# EAGLE design audible (EAGLE 7.5.0)
AUTHOR: BLEES Dev Team; REV: A; TITLE: BLEES Sensor Board
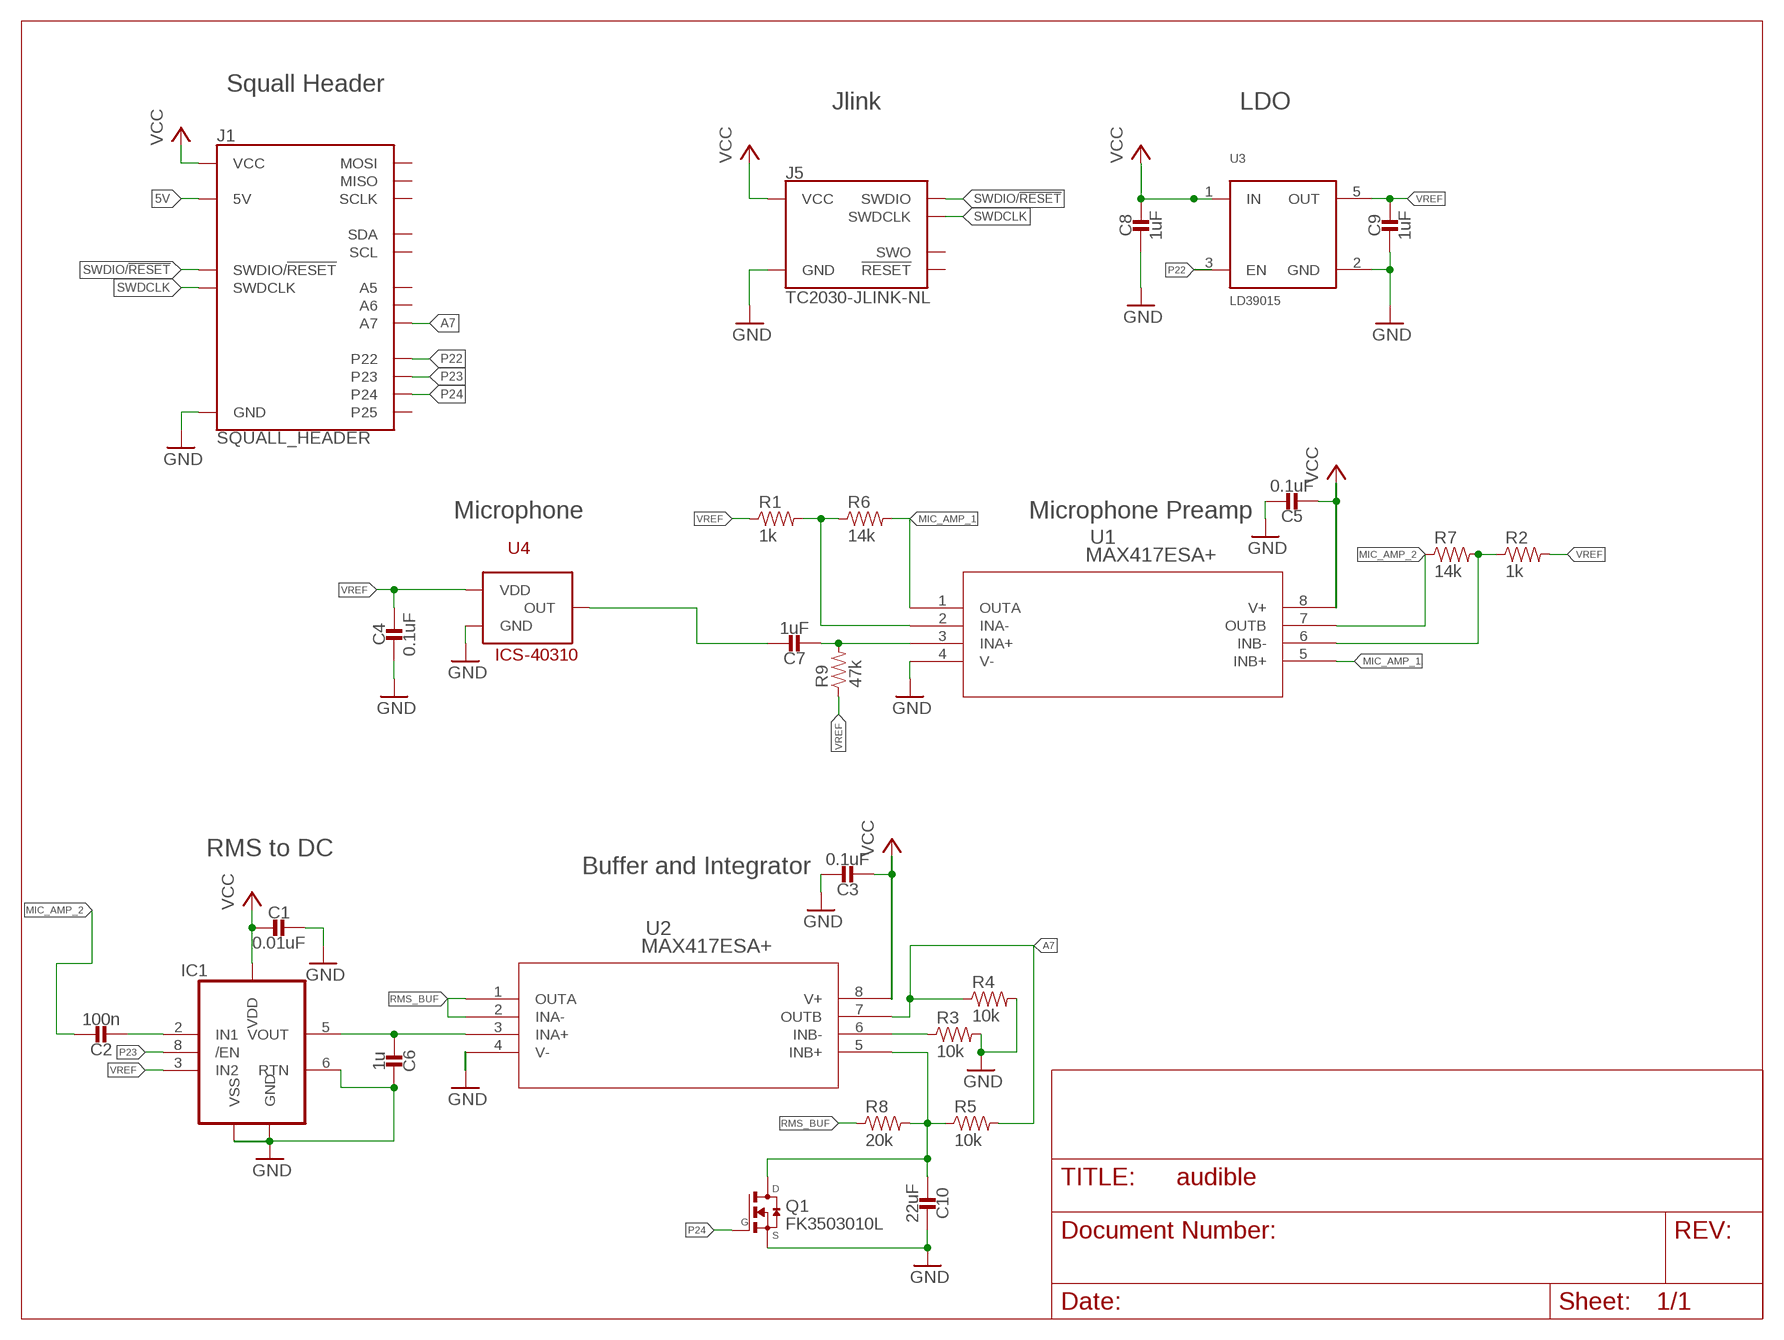
[diagram p0: schematic, sheet 1]

## Parts
C1  0.01uF  CAPACITOR  [0402_CAP]
C2  100n  CAPACITOR  [0402_CAP]
C3  0.1uF  CAPACITOR  [0402_CAP]
C4  0.1uF  CAPACITOR  [0402_CAP]
C5  0.1uF  CAPACITOR  [0402_CAP]
C6  1u  CAPACITOR  [0402_CAP]
C7  1uF  CAPACITOR  [0402_CAP]
C8  1uF  CAPACITOR  [0402_CAP]
C9  1uF  CAPACITOR  [0402_CAP]
C10  22uF  CAPACITOR  [0402_CAP]
IC1  LTC1966CMS8  [MSOP8]
J1  SQUALL_HEADER  [SQUALL_HEADER]
J5  TC2030-JLINK-NL  [TC2030-IDC-NL]
Q1  FK3503010L  [SC85]
R1  1k  RESISTOR0402_RES  [0402_RES]
R2  1k  RESISTOR0402_RES  [0402_RES]
R3  10k  RESISTOR0402_RES  [0402_RES]
R4  10k  RESISTOR0402_RES  [0402_RES]
R5  10k  RESISTOR0402_RES  [0402_RES]
R6  14k  RESISTOR0402_RES  [0402_RES]
R7  14k  RESISTOR0402_RES  [0402_RES]
R8  20k  RESISTOR0402_RES  [0402_RES]
R9  47k  RESISTOR0402_RES  [0402_RES]
U1  MAX417ESA+  [21-0041B_8]
U2  MAX417ESA+  [21-0041B_8]
U3  LD39015  [SOT-23-5]
U4  ICS-40310  [LGA_CAV3]

## Nets
5V: J1.A5(5V) J1.A7(5V)
A7: J1.B5(A7) R4.1 R5.2 U2.7(OUTB)
GND: C1.1 C3.1 C4.2 C5.1 C6.1 C8.2 C9.2 C10.1 IC1.1(GND) IC1.4(VSS) IC1.6(RTN) J1.A9(GND) J1.A10(GND) J5.5(GND) Q1.2(S) R3.2 R4.2 U1.4(V-) U2.4(V-) U3.2(GND) U4.P$2(GND)
MIC: C7.1 U4.P$1(OUT)
MIC_AMP_1: R6.2 U1.1(OUTA) U1.5(INB+)
MIC_AMP_2: C2.1 R7.1 U1.7(OUTB)
N$1: C7.2 R9.2 U1.3(INA+)
N$2: C2.2 IC1.2(IN1)
N$3: C6.2 IC1.5(VOUT) U2.3(INA+)
N$4: R1.2 R6.1 U1.2(INA-)
N$5: R2.1 R7.2 U1.6(INB-)
N$6: R3.1 U2.6(INB-)
N$10: C10.2 Q1.3(D) R5.1 R8.2 U2.5(INB+)
P22: J1.A2(P22) U3.3(EN)
P23: IC1.8(/EN) J1.A4(P23)
P24: J1.A6(P24) Q1.1(G)
RMS_BUF: R8.1 U2.1(OUTA) U2.2(INA-)
SWDCLK: J1.B2(SWDCLK) J5.4(SWDCLK)
SWDIO/!RESET: J1.B4(SWDIO/!RESET) J5.2(SWDIO)
VCC: C1.2 C3.2 C5.2 C8.1 IC1.7(VDD) J1.A1(VCC) J1.A3(VCC) J5.1(VCC) U1.8(V+) U2.8(V+) U3.1(IN)
VREF: C4.1 C9.1 IC1.3(IN2) R1.1 R2.2 R9.1 U3.5(OUT) U4.P$3(VDD)
Unconnected: J1.A8(P25) J1.B1(SDA) J1.B3(SCL) J1.B6(MOSI) J1.B7(A6) J1.B8(MISO) J1.B9(A5) J1.B10(SCLK) J5.3(!RESET) J5.6(SWO)

## Notes on the sheet
- Squall Header
- Jlink | LDO
- Microphone | Microphone Preamp
- RMS to DC
- Buffer and Integrator

## Library data of the parts
C1-C10 = passives:CAPACITOR: 0402 Capacitor
IC1 = chips:LTC1966*: Precision Micropower, DS RMS-to-DC Converter
J1 = squall:SQUALL_HEADER: Header for a sensor board on top of the Squall BLE tag board. Requires two DF40C-10DS-0.4V(51).; DIGIKEY: H11617CT-ND
J5 = connector:TC2030-JLINK
Q1 = chips:FK3503010L: N-CHANNEL MOSFET
R1-R9 = passives:RESISTOR: Resistor Basic schematic elements and footprints for 0603, 1206, and PTH resistors.
U1 U2 = chips:MAX417ESA+: Maxim Dual Single Supply Op Amp; MANUFACTURER_PART_NUMBER: max417esa+; VENDOR: MAXIM
U3 = chips:LD39015: 150 mA low quiescent current and low noise voltage regulator
U4 = chips:ICS-40310: Ultra-low Current, Low-Noise Microphone with Analog Output

## Board
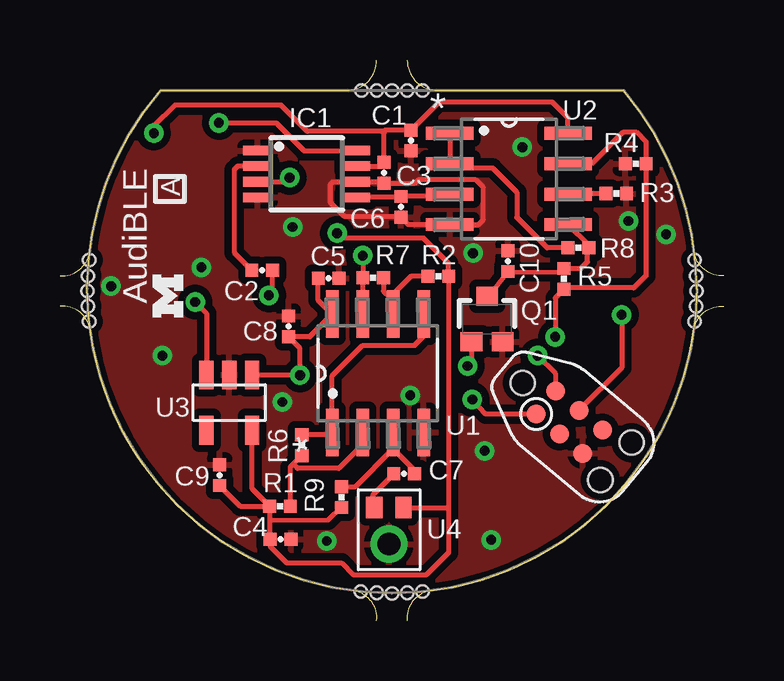
[diagram p1: board, top side]
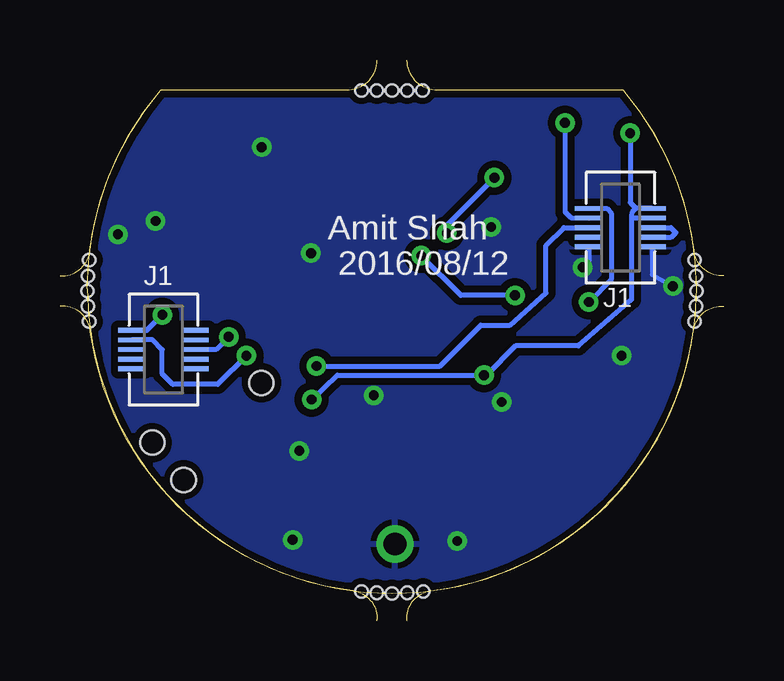
[diagram p2: board, bottom side, seen from below]

Size 27.69 x 23.37 mm. Coordinates in mm from the lower left corner, seen from the top.
Outline: 13.21,23.37 arc-90 11.94,22.1 4.19,22.1 arc33 1.24,15.44 arc-90 0,14.38
Outline: 14.48,23.37 arc90 15.75,22.1 23.49,22.1 arc-33 26.44,15.44 arc90 27.69,14.38
Outline: 0,13.11 arc-90 1.27,12.04 arc75 12.22,1.25 arc-90 13.21,0
Outline: 27.69,13.11 arc90 26.42,12.04 arc-75 15.47,1.25 arc90 14.48,0
Copper layers (1*16): Top 0.0178mm / dielectric 59mil / Bottom 0.0178mm
Design rules "sunstone-2lyr_v1.0.0.3 *": minimum track width 6mil, minimum drill 14mil, track to track 6mil, track to pad 6mil, pad to pad 6mil, via to via 6mil, smd to smd 6mil, copper to edge 10mil, drill to drill 16mil, minimum pad ring 8mil, minimum via ring 8mil, stop-mask expansion 3mil, vias tented up to drill 50mil, thermal gap 10mil
Holes 0.51 mm at 13.84,22.1 14.48,22.1 15.11,22.1 13.21,22.1 12.57,22.1 1.14,13.74 1.17,14.38 1.22,15.04 1.17,13.11 1.22,12.47 26.54,13.74 26.52,14.38 26.47,15.04 26.52,13.11 26.47,12.47 13.84,1.14 13.21,1.17 12.55,1.22 14.48,1.17 15.11,1.22
Milling: 4 lines

### Footprints (pad centres in the part's own frame; a part is rotated, then mirrored left to right if it is on the bottom)
0402_CAP = smd 0.536 x 0.546: 1 -0.433,0; 2 0.433,0
MSOP8 = smd 0.4 x 1.2: 1 -0.975,-2.05; 2 -0.325,-2.05; 3 0.325,-2.05; 4 0.975,-2.05; 5 0.975,2.05; 6 0.325,2.05; 7 -0.325,2.05; 8 -0.975,2.05
SQUALL_HEADER = smd 1.14 x 0.2 bottom: A1 -10.845,3.34; A2 -8.205,3.34; A3 -10.845,2.94; A4 -8.205,2.94; A5 -10.845,2.54; A6 -8.205,2.54; A7 -10.845,2.14; A8 -8.205,2.14; A9 -10.845,1.74; A10 -8.205,1.74; B1 8.205,-1.74; B2 10.845,-1.74; B3 8.205,-2.14; B4 10.845,-2.14; B5 8.205,-2.54; B6 10.845,-2.54; B7 8.205,-2.94; B8 10.845,-2.94; B9 8.205,-3.34; B10 10.845,-3.34
TC2030-IDC-NL = smd 0.787 x 0.787: 1 -1.27,-0.635; 2 -1.27,0.635; 3 0,-0.635; 4 0,0.635; 5 1.27,-0.635; 6 1.27,0.635 | hole 1.016: -2.54,0; 2.54,1.016; 2.54,-1.016
SC85 = smd 0.9 x 0.8: 1 -0.65,-0.95; 2 0.65,-0.95; 3 0,0.95
0402_RES = smd 0.536 x 0.546: 1 -0.433,0; 2 0.433,0
21-0041B_8 = smd 1.981 x 0.533: 1 -2.464,1.905; 2 -2.464,0.635; 3 -2.464,-0.635; 4 -2.464,-1.905; 5 2.464,-1.905; 6 2.464,-0.635; 7 2.464,0.635; 8 2.464,1.905
SOT-23-5 = smd 0.6 x 1.2: 1 -0.95,-1.15; 2 0,-1.15; 3 0.95,-1.15; 4 0.95,1.15; 5 -0.95,1.15
LGA_CAV3 = smd 0.9 x 0.68: P$1 -1.52,-0.61; P$3 -1.52,0.61 | drill 0.95 pad 1.55: P$2 0,0

### Placement (x,y rotation side)
C1  14.63,20.02 90 top
C2  8.43,14.61 180 top
C3  13.51,18.67 90 top
C4  9.19,3.4 0 top
C5  11.2,14.27 180 top
C6  14.22,17.25 90 top
C7  14.35,6.12 0 top
C8  9.53,12.27 90 top
C9  6.65,6.07 90 top
C10  18.67,14.99 270 top
IC1  10.29,18.62 270 top
J1  13.84,13.84 0 top
J5  21.23,8.28 320 top
Q1  17.81,12.57 0 top
R1  9.17,4.78 0 top
R2  15.77,14.35 0 top
R3  23.19,17.81 0 top
R4  24,19.05 180 top
R5  21.01,14.25 270 top
R6  10.08,7.32 90 top
R7  13.06,14.3 0 top
R8  21.62,15.54 0 top
R9  11.73,5.16 90 top
U1  13.26,10.31 90 top
U2  18.72,18.41 0 top
U3  7.06,9.09 180 top
U4  13.72,3.2 270 top
U$1  [UMICH_SOLID_50MIL]  4.5,13.54 90 top

### Tracks (layer width: path | path; a pad name or v marks a point on that pad's centre or on a via)
5V
  Bottom 0.203: J1.A5 2.21,16.38 2.01,16.18 2.2,15.98 J1.A7
A7  (via drill 0.41)
  Top 0.203: v20.65,11.84 20.65,13.46 R5.2 21.06,13.87 23.93,13.87 24.44,14.38 R4.1 24.44,19.96 24.03,20.37 23.49,20.37 22.17,19.05 U2.7
  Top 0.254: R5.2 21.13,13.95
  Bottom 0.203: v20.65,11.84 21.18,11.3 J1.B5
GND  (via drill 0.41)
  Top 0.203: C3.1 14.81,18.24 14.96,18.39 17.32,18.39 17.63,18.09 17.63,16.69 17.42,16.48 16.31,16.48 16.26,16.43 U2.4 14.53,16.51 C6.1 14.17,16.87 11.84,16.87 11.28,17.42 11.28,18.19 11.38,18.29 12.5,18.29 | 14.78,19.43 C1.1 | C3.1 13.35,18.39 | 11.71,14.35 C5.1 | C3.1 13.46,18.29 IC1.6 12.28,18.24 | 23.62,19 R4.2
  Bottom 0.203: J1.A9 3,14.43 v2.13,13.95 | J1.A10 5.64,14.99 v5.89,14.73
  other vias: 17.7,7.09 14.6,9.4 9.7,16.41 11.13,3.33 23.7,16.66 25.27,16.1 19.28,19.74 17.98,3.38 4.27,11.05 9.27,9.12 17.22,15.32
  pour Top (isolate 0.305): 26.54,13.84 arc-180 1.14,13.84 arc-41 4.19,22.1 23.49,22.1 arc-41
  pour Bottom (isolate 0.305): 26.54,13.84 arc-180 1.14,13.84 arc-41 4.19,22.1 23.49,22.1 arc-41
  pour Bottom (isolate 0.305): 26.54,13.84 arc-180 1.14,13.84 arc-41 4.19,22.1 23.49,22.1 arc-41
MIC
  Top 0.203: U4.P$1 13.05,4.77 13.05,5.26 C7.1
MIC_AMP_1
  Top 0.203: R6.2 11.25,7.75 U1.1 11.35,10.21 12.62,11.48 14.78,11.48 15.32,12.01 15.32,12.62 U1.5
MIC_AMP_2  (via drill 0.41)
  Top 0.203: R7.1 U1.7 | v12.62,15.21 12.65,14.12 | v8.71,13.56 8.87,13.72 C2.1
  Top 0.254: 12.65,14.12 R7.1
  Bottom 0.203: v8.71,13.56 10.97,13.56 v12.62,15.21
N$1
  Top 0.203: C7.2 14.78,6.27 13.89,7.16 | 13.89,7.16 U1.3 | R9.2 12.32,5.59 13.89,7.16
N$2
  Top 0.203: IC1.2 7.41,18.94 7.26,18.8 7.26,15.34 C2.2 8.08,14.68
N$3
  Top 0.203: U2.3 15.52,17.7 14.25,17.7 C6.2 12.37,17.68 IC1.5
N$4
  Top 0.203: R6.1 9.73,6.53 | 9.73,6.53 9.6,6.4 R1.2 | U1.2 12.62,7.34 11.63,6.35 9.91,6.35 9.73,6.53
N$5
  Top 0.203: R7.2 13.49,13.74 13.75,13.48 | 13.75,13.48 13.92,13.31 13.92,12.8 U1.6 | R2.1 14.63,14.35 13.75,13.48
N$6
  Top 0.203: R3.1 21.21,17.8 U2.6
N$10
  Top 0.203: U2.5 22.05,15.65 R8.2 22,15.49 22,14.96 21.72,14.68 R5.1 20.85,14.53 C10.2 17.89,13.52 Q1.3
P22  (via drill 0.41)
  Top 0.203: v5.64,13.28 6.11,12.81 U3.3
  Bottom 0.203: J1.A2 4.89,17.18 4.7,16.99 4.7,14.22 v5.64,13.28
P23  (via drill 0.41)
  Top 0.203: v6.63,20.75 9.02,20.75 10.19,19.58 IC1.8
  Bottom 0.203: v6.63,20.75 6.63,17.04 6.4,16.82 6.35,16.79 J1.A4
P24  (via drill 0.41)
  Top 0.203: Q1.1 17.16,10.78 v16.99,10.62
  Bottom 0.203: v16.99,10.62 11.84,10.62 10.13,12.32 8.92,12.32 7.42,13.67 7.42,15.65 6.68,16.38 J1.A6
RMS_BUF
  Top 0.203: U2.1 U2.2 16.43,18.87 18.03,18.87 19.05,17.86 19.05,16.82 20.32,15.54 R8.1
SWDCLK  (via drill 0.41)
  Top 0.203: v23.42,12.75 23.42,10.54 J5.4
  Bottom 0.203: v23.42,12.75 24.07,12.1 J1.B2
SWDIO/!RESET  (via drill 0.41)
  Top 0.203: J5.2 20.67,10.29 v19.91,11.05
  Bottom 0.203: v19.91,11.05 21.11,9.86 22.99,9.86 23.42,10.29 23.42,11.3 23.82,11.7 J1.B4
VCC  (via drill 0.41)
  Top 0.203: J5.1 17.76,8.61 v17.2,9.22 | U2.8 21.18,20.96 20.52,21.62 15.8,21.62 C1.2 13.56,20.45 13.51,20.4 13.44,20.4 | C5.2 10.77,13.36 U1.8 10.41,11.84 C8.1 10.01,11.35 v10.01,10.24 v10,10.24 U3.1 | IC1.7 13.35,18.94 C3.2 13.51,20.32 13.44,20.4 | 13.44,20.4 10.31,20.4 9.22,21.49 4.8,21.49 3.91,20.6 v3.91,20.32
  Top 0.254: C3.2 13.46,19.05
  Bottom 0.203: v17.2,9.22 16.13,10.24 v10.01,10.24 9.91,10.24 8.69,11.46 6.07,11.46 3.86,13.39 3.86,16.87 | J1.A1 3.67,17.18 | 3.67,17.18 3.83,17.02 3.86,16.87 | J1.A3 3.79,16.78 3.86,16.87 | v3.91,20.32 3.91,17.42 3.67,17.18
VREF  (via drill 0.41)
  Top 0.203: 16.2,4.75 R2.2 16.21,14.91 15.16,15.95 11.76,15.95 v11.56,16.15 | 16.2,4.75 16.2,2.84 15.29,1.93 12.22,1.93 11.73,2.41 9.45,2.41 8.76,3.1 C4.1 8.76,4.17 | 16.2,4.75 16.18,4.72 U4.P$3 | 8.76,4.17 8.76,4.75 R1.1 | R1.1 8.01,5.5 U3.5 | R9.1 11.18,4.19 8.76,4.17 | IC1.3 9.4,18.29 v9.58,18.47 | C9.1 7.52,4.78 R1.1
  Top 0.254: C4.1 8.76,3.56
  Bottom 0.203: v11.56,16.15 11.56,16.48 v9.58,18.47

### Text on the board
tPlace: AudiBLE | A
bPlace: Amit Shah | 2016/08/12 | J1 | J1
tNames: U2 | U1 | U4